# EAGLE design Shruthi-Digital-v04b (EAGLE 5.09)
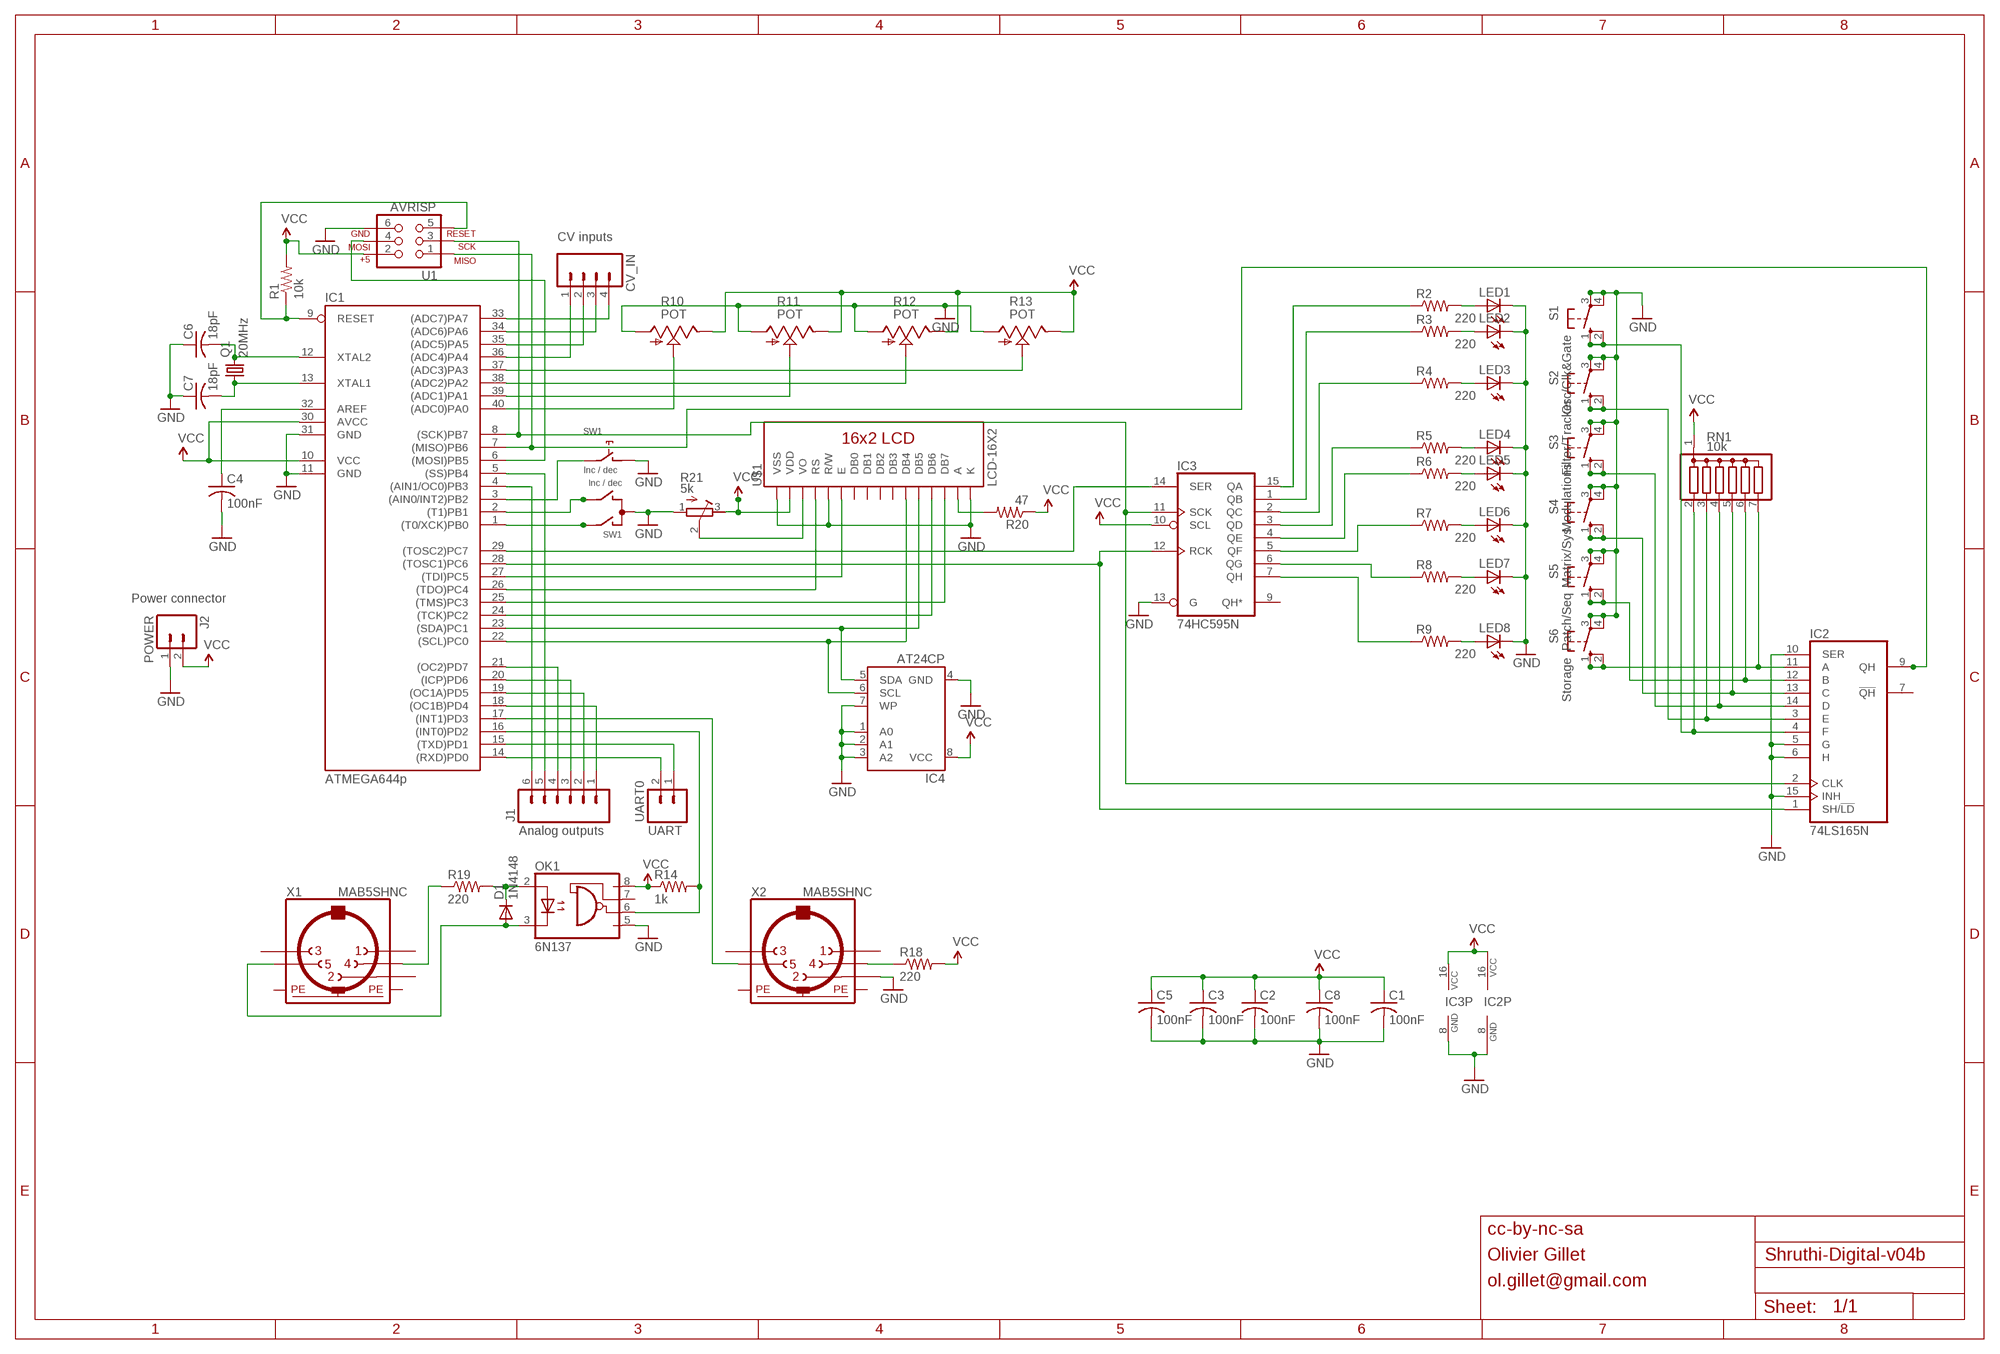
[diagram p0: schematic, sheet 1]

## Parts
C1  100nF  C-US025-024X044  [C025-024X044]
C2  100nF  C-US025-024X044  [C025-024X044]
C3  100nF  C-US025-024X044  [C025-024X044]
C4  100nF  C-US025-024X044  [C025-024X044]
C5  100nF  C-US025-024X044  [C025-024X044]
C6  18pF  C-US025-024X044  [C025-024X044]
C7  18pF  C-US025-024X044  [C025-024X044]
C8  100nF  C-US025-024X044  [C025-024X044]
CV_IN  M04PTH  [1X04]
D1  1N4148  DIODE-D-5  [D-5]
IC1  ATMEGA644p  MEGA16-P  [DIL40]
IC2  74LS165N  [DIL16]
IC3  74HC595N  [DIL16]
IC4  AT24CP  [DIL08]
J1  M06SIP  [1X06]
J2  POWER  M02PTH  [1X02]
LED1  LED3MM  [LED3MM]
LED2  LED3MM  [LED3MM]
LED3  LED3MM  [LED3MM]
LED4  LED3MM  [LED3MM]
LED5  LED3MM  [LED3MM]
LED6  LED3MM  [LED3MM]
LED7  LED3MM  [LED3MM]
LED8  LED3MM  [LED3MM]
OK1  6N137  [DIL08]
Q1  20MHz  CRYSTALHC49U-V  [HC49U-V]
R1  10k  R-US_0204/7  [0204/7]
R2  220  R-US_0204/7  [0204/7]
R3  220  R-US_0204/7  [0204/7]
R4  220  R-US_0204/7  [0204/7]
R5  220  R-US_0204/7  [0204/7]
R6  220  R-US_0204/7  [0204/7]
R7  220  R-US_0204/7  [0204/7]
R8  220  R-US_0204/7  [0204/7]
R9  220  R-US_0204/7  [0204/7]
R10  POT  POT_US  [ALPS_POT_SFE]
R11  POT  POT_US  [ALPS_POT_SFE]
R12  POT  POT_US  [ALPS_POT_SFE]
R13  POT  POT_US  [ALPS_POT_SFE]
R14  1k  R-US_0204/7  [0204/7]
R18  220  R-US_0204/7  [0204/7]
R19  220  R-US_0204/7  [0204/7]
R20  47  R-US_0204/7  [0204/7]
R21  5k  R-TRIMM3296W  [RTRIM3296W]
RN1  10k  G06R  [SIL7]
S1  Osc/Clk&Gate  40-XX  [B3F-40XX]
S2  Filter/Tracker  40-XX  [B3F-40XX]
S3  Modulations  40-XX  [B3F-40XX]
S4  Matrix/Sys  40-XX  [B3F-40XX]
S5  Patch/Seq  40-XX  [B3F-40XX]
S6  Storage  40-XX  [B3F-40XX]
SW1  Inc / dec  EC12E_SW  [ALPS_EC12E_SW]
U1  AVRISP  AVR_SPI_PRG_6PTH  [2X3]
U$1  LCD-16X2  [LCD-16X2]
UART0  M02LOCK  [1X02_LOCK]
X1  MAB5SHNC  [MAB5SH-NC]
X2  MAB5SHNC  [MAB5SH-NC]

## Nets
GND: C1.2 C2.2 C3.2 C4.2 C5.2 C6.1 C7.1 C8.2 IC1.11(GND) IC1.31(GND) IC2.5(G) IC2.6(H) IC2.8(GND) IC2.10(SER) IC2.15(INH) IC3.8(GND) IC3.13(G) IC4.1(A0) IC4.2(A1) IC4.3(A2) IC4.4(GND) IC4.7(WP) J2.1 LED1.K(C) LED2.K(C) LED3.K(C) LED4.K(C) LED5.K(C) LED6.K(C) LED7.K(C) LED8.K(C) OK1.5(GND) R10.P$3(A) R11.P$3(A) R12.P$3(A) R13.P$3(A) R21.1(E) S1.3(P) S1.4(P1) S2.3(P) S2.4(P1) S3.3(P) S3.4(P1) S4.3(P) S4.4(P1) S5.3(P) S5.4(P1) S6.3(P) S6.4(P1) SW1.C SW1.D U1.6 U$1.1(VSS) U$1.5(R/W) U$1.16(K) X2.2
N$1: IC3.2(QC) R4.1
N$2: IC1.14((RXD)PD0) UART0.2
N$3: IC2.11(A) RN1.7 S6.1(S) S6.2(S1)
N$5: IC2.3(E) RN1.3 S2.1(S) S2.2(S1)
N$6: IC1.9(RESET) R1.1 U1.5
N$7: C4.1 IC1.32(AREF)
N$8: IC1.8((SCK)PB7) IC2.2(CLK) IC3.11(SCK) U1.3
N$9: IC1.7((MISO)PB6) IC2.9(QH) U1.1
N$10: CV_IN.1 IC1.36((ADC4)PA4)
N$11: CV_IN.2 IC1.35((ADC5)PA5)
N$12: CV_IN.3 IC1.34((ADC6)PA6)
N$13: CV_IN.4 IC1.33((ADC7)PA7)
N$14: IC1.40((ADC0)PA0) R10.P$2(S)
N$15: IC1.39((ADC1)PA1) R11.P$2(S)
N$16: IC1.38((ADC2)PA2) R12.P$2(S)
N$17: IC1.37((ADC3)PA3) R13.P$2(S)
N$18: IC1.4((AIN1/OC0)PB3) J1.6
N$19: IC1.5((SS)PB4) J1.5
N$20: IC1.18((OC1B)PD4) J1.1
N$21: IC1.19((OC1A)PD5) J1.2
N$22: IC1.20((ICP)PD6) J1.3
N$23: IC1.21((OC2)PD7) J1.4
N$25: IC1.15((TXD)PD1) UART0.1
N$26: IC1.22((SCL)PC0) IC4.6(SCL) U$1.11(DB4)
N$27: IC1.26((TDO)PC4) U$1.4(RS)
N$28: D1.C OK1.2(A) R19.2
N$29: IC1.28((TOSC1)PC6) IC2.1(SH/!LD) IC3.12(RCK)
N$30: IC3.15(QA) R2.1
N$31: IC3.1(QB) R3.1
N$33: IC3.3(QD) R5.1
N$34: IC3.4(QE) R6.1
N$35: IC3.5(QF) R7.1
N$36: IC3.7(QH) R9.1
N$37: IC3.6(QG) R8.1
N$42: LED1.A R2.2
N$43: LED2.A R3.2
N$44: LED3.A R4.2
N$45: LED4.A R5.2
N$46: LED5.A R6.2
N$47: LED6.A R7.2
N$48: LED7.A R8.2
N$49: LED8.A R9.2
N$57: IC1.6((MOSI)PB5) U1.4
N$58: IC1.29((TOSC2)PC7) IC3.14(SER)
N$59: IC2.4(F) RN1.2 S1.1(S) S1.2(S1)
N$61: IC2.14(D) RN1.4 S3.1(S) S3.2(S1)
N$62: IC2.13(C) RN1.5 S4.1(S) S4.2(S1)
N$63: IC2.12(B) RN1.6 S5.1(S) S5.2(S1)
N$64: IC1.1((T0/XCK)PB0) SW1.A
N$65: IC1.2((T1)PB1) SW1.B
N$66: IC1.3((AIN0/INT2)PB2) SW1.E
N$68: R18.1 X2.4
N$69: IC1.17((INT1)PD3) X2.5
N$70: IC1.16((INT0)PD2) OK1.6(VO) R14.2
N$71: IC1.23((SDA)PC1) IC4.5(SDA) U$1.12(DB5)
N$72: R19.1 X1.4
N$73: D1.A OK1.3(C) X1.5
N$74: IC1.24((TCK)PC2) U$1.13(DB6)
N$75: IC1.25((TMS)PC3) U$1.14(DB7)
N$76: IC1.27((TDI)PC5) U$1.6(E)
N$78: R21.2(S) U$1.3(VO)
N$79: R20.2 U$1.15(A)
N$82: C7.2 IC1.13(XTAL1) Q1.1
N$83: C6.2 IC1.12(XTAL2) Q1.2
VCC: C1.1 C2.1 C3.1 C5.1 C8.1 IC1.10(VCC) IC1.30(AVCC) IC2.16(VCC) IC3.10(SCL) IC3.16(VCC) IC4.8(VCC) J2.2 OK1.8(VCC) R1.2 R10.P$1(E) R11.P$1(E) R12.P$1(E) R13.P$1(E) R14.1 R18.2 R20.1 R21.3(A) RN1.1 U1.2 U$1.2(VDD)
Unconnected: IC2.7(!QH) IC3.9(QH*) OK1.7(VE) SW1.GND1(G) SW1.GND2(G) U$1.7(DB0) U$1.8(DB1) U$1.9(DB2) U$1.10(DB3) X1.1 X1.2 X1.3 X2.1 X2.3

## Notes on the sheet
- CV inputs
- Power connector
- Analog outputs | UART
- cc-by-nc-sa
- Olivier Gillet
- ol.gillet@gmail.com

## Power pins joined to a net without a drawn wire
PE: X1.PE X1.PE@(PE) X2.PE X2.PE@(PE)

## Library data of the parts
C1-C8 = rcl:C-US: CAPACITOR, American symbol
CV_IN = SparkFun:M04: Header 4 Standard 4-pin 0.1" header. Use with straight break away headers (SKU : PRT-00116), right angle break away headers (PRT-00553), swiss pins (PRT-00743), machine pins (PRT-00117), and female headers (PRT-00115). Molex polarized connector foot print use with SKU : PRT-08231 with associated crimp pins and housings.
D1 = diode:DIODE-: DIODE
IC1 = atmel:MEGA16-P: MICROCONTROLLER 16 Kbytes FLASH 1 kbytes SRAM 512 bytes EEPROM USART 8-channel 10 bit ADC Source: avr.lbr
IC2 = 74xx-us:74*165: 8-bit parallel load SHIFT REGISTER
IC3 = 74xx-eu:74*595: 8-bit SHIFT REGISTER, output latch
IC4 = atmel:AT24C*: 2-wire serial EEPROM
J1 = SparkFun:M06: Header 6 Standard 6-pin 0.1" header. Use with straight break away headers (SKU : PRT-00116), right angle break away headers (PRT-00553), swiss pins (PRT-00743), machine pins (PRT-00117), and female headers (PRT-00115). Molex polarized connector foot print use with SKU : PRT-08094 with associated crimp pins and housings. NOTES ON THE VARIANTS LOCK and LOCK_LONGPADS... This footprint was designed to help hold the alignment of a through-hole component (i.e. 6-pin header) while soldering it into place. You may notice that each hole has been shifted either up or down by 0.005 of an inch from it's more standard position (which is a perfectly straight line). This slight alteration caused the pins (the squares in the middle) to touch the edges of the holes. Because they are alternating, it causes a "brace" to hold the component in place. 0.005 has proven to be the perfect amount of "off-center" position when using our standard breakaway headers. Although looks a little odd when you look at the bare footprint, once you have a header in there, the alteration is very hard to notice. Also, if you push a header all the way into place, it is covered up entirely on the bottom side. This idea of altering the position of holes to aid alignment will be further integrated into the Sparkfun Library for other footprints. It can help hold any component with 3 or more connection pins.
J2 UART0 = SparkFun:M02: Header 2 Standard 2-pin 0.1" header. Use with straight break away headers (SKU : PRT-00116), right angle break away headers (PRT-00553), swiss pins (PRT-00743), machine pins (PRT-00117), and female headers (PRT-00115). Molex polarized connector foot print use with SKU : PRT-08233 with associated crimp pins and housings.
LED1-LED8 = led:LED: LED OSRAM: - CHIPLED LG R971, LG N971, LY N971, LG Q971, LY Q971, LO R971, LY R971 LH N974, LH R974 LS Q976, LO Q976, LY Q976 LO Q996 - Hyper CHIPLED LW Q18S LB Q993, LB Q99A, LB R99A - SideLED LS A670, LO A670, LY A670, LG A670, LP A670 LB A673, LV A673, LT A673, LW A673 LH A674 LY A675 LS A676, LA A676, LO A676, LY A676, LW A676 LS A679, LY A679, LG A679 - Hyper Micro SIDELED® LS Y876, LA Y876, LO Y876, LY Y876 LT Y87S - SmartLED LW L88C, LW L88S LB L89C, LB L89S, LG L890 LS L89K, LO L89K, LY L89K LS L896, LA L896, LO L896, LY L896 - TOPLED LS T670, LO T670, LY T670, LG T670, LP T670 LSG T670, LSP T670, LSY T670, LOP T670, LYG T670 LG T671, LOG T671, LSG T671 LB T673, LV T673, LT T673, LW T673 LH T674 LS T676, LA T676, LO T676, LY T676, LB T676, LH T676, LSB T676, LW T676 LB T67C, LV T67C, LT T67C, LS T67K, LO T67K, LY T67K, LW E67C LS E67B, LA E67B, LO E67B, LY E67B, LB E67C, LV E67C, LT E67C LW T67C LS T679, LY T679, LG T679 LS T770, LO T770, LY T770, LG T770, LP T770 LB T773, LV T773, LT T773, LW T773 LH T774 LS E675, LA E675, LY E675, LS T675 LS T776, LA T776, LO T776, LY T776, LB T776 LHGB T686 LT T68C, LB T68C - Hyper Mini TOPLED® LB M676 - Mini TOPLED Santana® LG M470 LS M47K, LO M47K, LY M47K Source: http://www.osram.convergy.de LUXEON: - LUMILED® LXK2-PW12-R00, LXK2-PW12-S00, LXK2-PW14-U00, LXK2-PW14-V00 LXK2-PM12-R00, LXK2-PM12-S00, LXK2-PM14-U00 LXK2-PE12-Q00, LXK2-PE12-R00, LXK2-PE12-S00, LXK2-PE14-T00, LXK2-PE14-U00 LXK2-PB12-K00, LXK2-PB12-L00, LXK2-PB12-M00, LXK2-PB14-N00, LXK2-PB14-P00, LXK2-PB14-Q00 LXK2-PR12-L00, LXK2-PR12-M00, LXK2-PR14-Q00, LXK2-PR14-R00 LXK2-PD12-Q00, LXK2-PD12-R00, LXK2-PD12-S00 LXK2-PH12-R00, LXK2-PH12-S00 LXK2-PL12-P00, LXK2-PL12-Q00, LXK2-PL12-R00 Source: www.luxeon.com KINGBRIGHT: KA-3528ASYC Source: www.kingbright.com
OK1 = optocoupler:6N137: MOTOROLA OPTO COUPLER
Q1 = crystal:CRYSTAL: CRYSTAL
R1-R9 R14 R18-R20 = rcl:R-US_: RESISTOR, American symbol
R10-R13 = pot-alps:POT_US
R21 = rcl:R-TRIMM: Trimm resistor
RN1 = resistor-sil:G06R: SIL RESISTOR
S1-S6 = switch-omron:40-XX: OMRON SWITCH
SW1 = switch-alps:EC12E_SW: ALPS rotary Encoder EC12E series with switch
U1 = SparkFun:AVR_SPI_PRG_6: AVR ISP 6 Pin This is the reduced ISP connector for AVR programming. Common on Arduino. This footprint will take up less PCB space and can be used with a 10-pin to 6-pin adapter such as SKU: BOB-08508
U$1 = SparkFun:LCD-16X2
X1 X2 = con-hirschmann:MAB5SH: Female CONNECTOR 5 pins 90 deg. with shield, horizontal (DIN 41524)

## Board
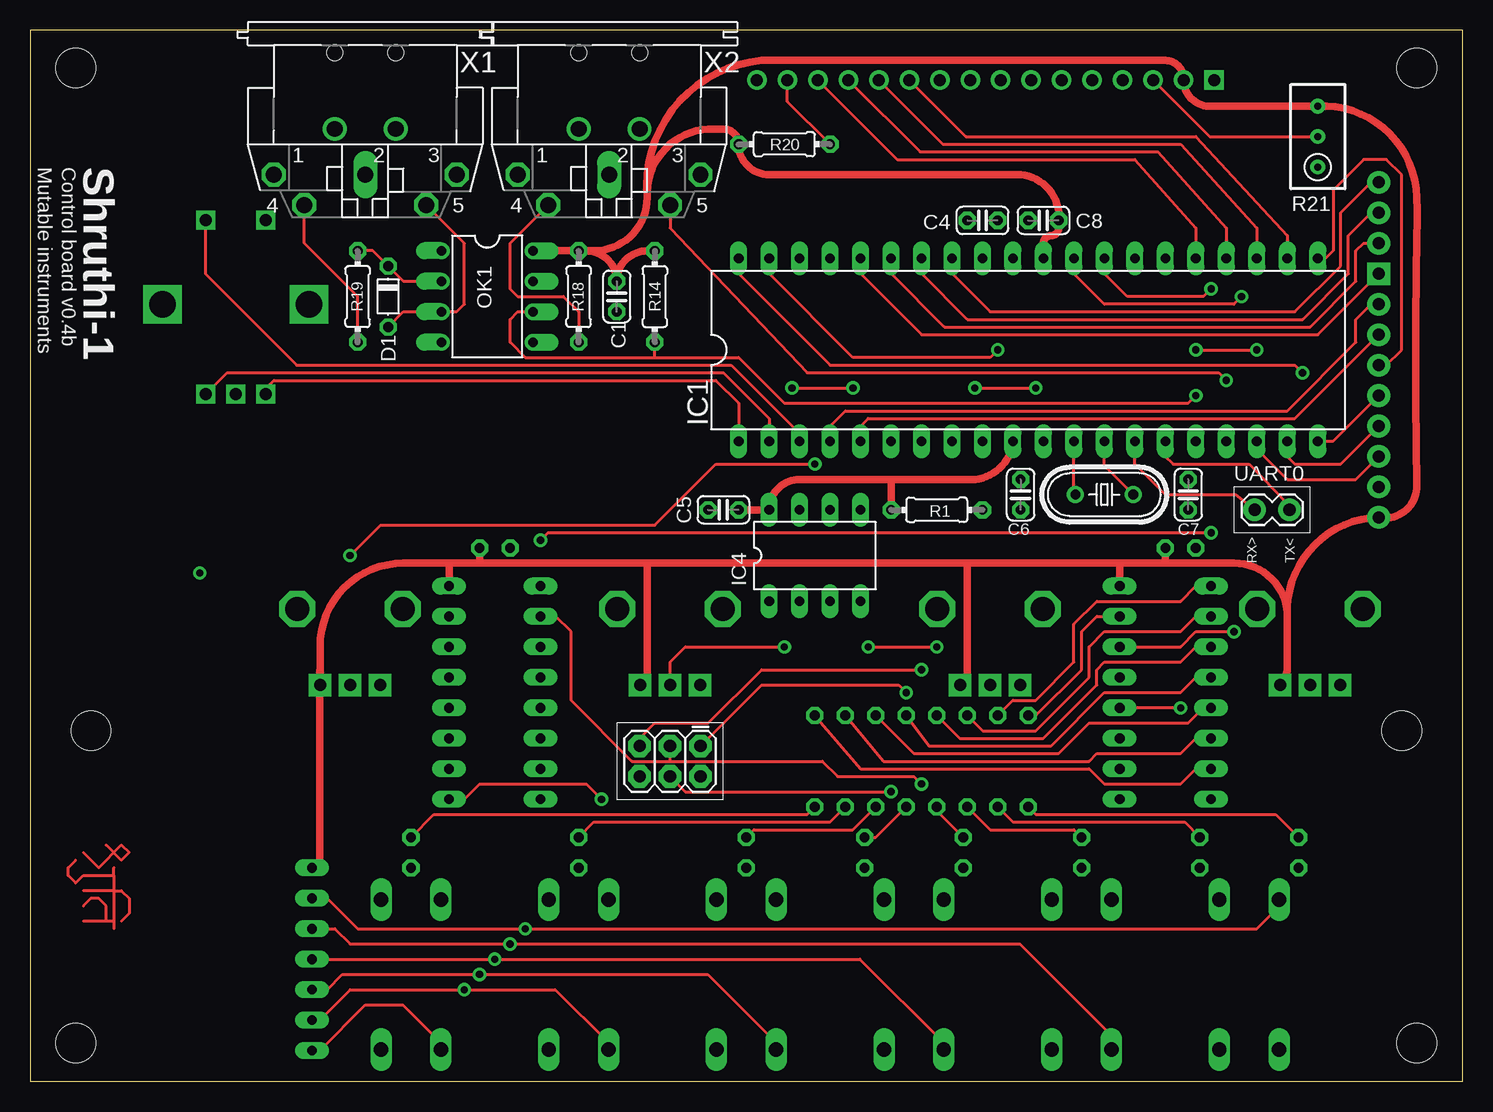
[diagram p1: board, top side]
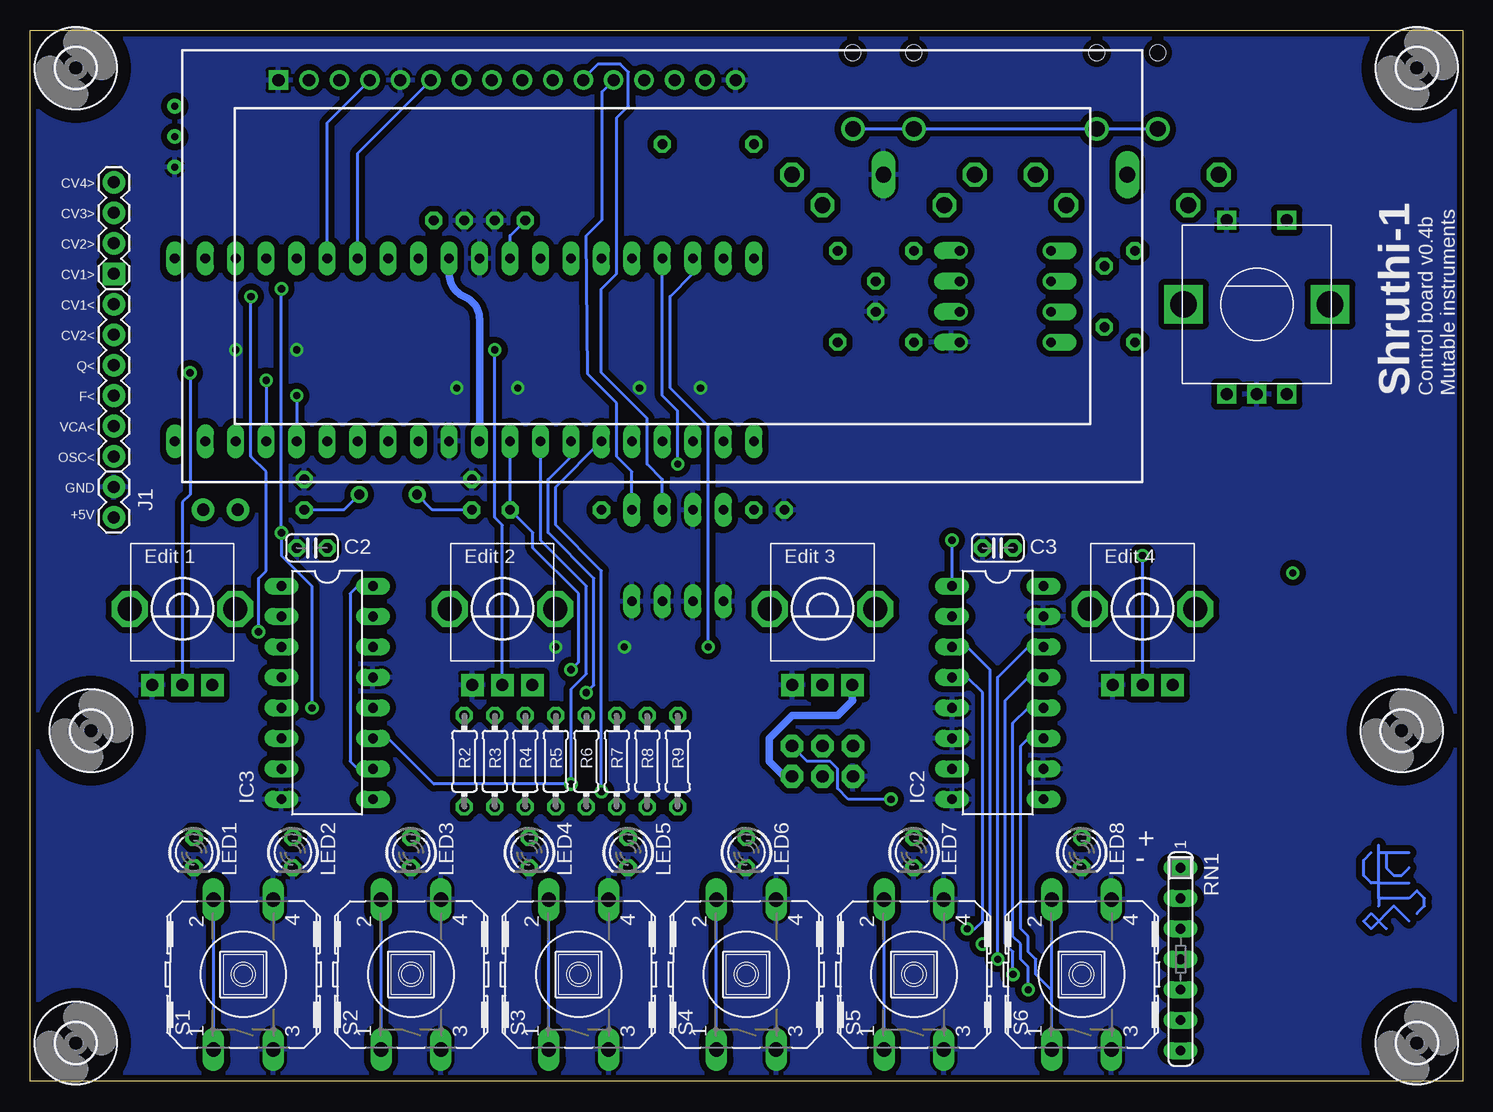
[diagram p2: board, bottom side, seen from below]

Size 119.38 x 87.63 mm. Coordinates in mm from the lower left corner, seen from the top.
Outline: 0,0 119.38,0 119.38,87.63 0,87.62 0,0
Copper layers (1*16): Top 0.035mm / dielectric 1.5mm / Bottom 0.035mm
Design rules "SparkFun": minimum track width 8mil, minimum drill 20mil, track to track 8mil, track to pad 8mil, pad to pad 8mil, via to via 8mil, smd to smd 8mil, copper to edge 10mil, drill to drill 8mil, minimum pad ring 12mil, minimum via ring 10mil, stop-mask expansion 4mil, vias tented up to drill 25mil, thermal gap 10mil

### Footprints (pad centres in the part's own frame; a part is rotated, then mirrored left to right if it is on the bottom)
C025-024X044 = drill 0.813 octagon: 1 -1.27,0; 2 1.27,0
1X04 = drill 1.016 pad 1.88 square: 1 0,0 | drill 1.016 pad 1.88 round: 2 2.54,0; 3 5.08,0; 4 7.62,0
D-5 = drill 0.813 octagon: A 2.54,0; C -2.54,0
DIL40 = drill 0.813 long: 1 -24.13,-7.62; 2 -21.59,-7.62; 3 -19.05,-7.62; 4 -16.51,-7.62; 5 -13.97,-7.62; 6 -11.43,-7.62; 7 -8.89,-7.62; 8 -6.35,-7.62; 9 -3.81,-7.62; 10 -1.27,-7.62; 11 1.27,-7.62; 12 3.81,-7.62; 13 6.35,-7.62; 14 8.89,-7.62; 15 11.43,-7.62; 16 13.97,-7.62; 17 16.51,-7.62; 18 19.05,-7.62; 19 21.59,-7.62; 20 24.13,-7.62; 21 24.13,7.62; 22 21.59,7.62; 23 19.05,7.62; 24 16.51,7.62; 25 13.97,7.62; 26 11.43,7.62; 27 8.89,7.62; 28 6.35,7.62; 29 3.81,7.62; 30 1.27,7.62; 31 -1.27,7.62; 32 -3.81,7.62; 33 -6.35,7.62; 34 -8.89,7.62; 35 -11.43,7.62; 36 -13.97,7.62; 37 -16.51,7.62; 38 -19.05,7.62; 39 -21.59,7.62; 40 -24.13,7.62
DIL16 = drill 0.813 long: 1 -8.89,-3.81; 2 -6.35,-3.81; 3 -3.81,-3.81; 4 -1.27,-3.81; 5 1.27,-3.81; 6 3.81,-3.81; 7 6.35,-3.81; 8 8.89,-3.81; 9 8.89,3.81; 10 6.35,3.81; 11 3.81,3.81; 12 1.27,3.81; 13 -1.27,3.81; 14 -3.81,3.81; 15 -6.35,3.81; 16 -8.89,3.81
DIL08 = drill 0.813 long: 1 -3.81,-3.81; 2 -1.27,-3.81; 3 1.27,-3.81; 4 3.81,-3.81; 5 3.81,3.81; 6 1.27,3.81; 7 -1.27,3.81; 8 -3.81,3.81
1X06 = drill 1.016 pad 1.88 round: 1 0,0; 2 2.54,0; 3 5.08,0; 4 7.62,0; 5 10.16,0; 6 12.7,0
1X02 = drill 1.016 pad 1.88 round: 1 0,0; 2 2.54,0
LED3MM = drill 0.813 octagon: A -1.27,0; K 1.27,0
DIL08' = drill 0.813 offset: 1 -3.81,-3.81; 2 -1.27,-3.81; 3 1.27,-3.81; 4 3.81,-3.81; 5 3.81,3.81; 6 1.27,3.81; 7 -1.27,3.81; 8 -3.81,3.81
HC49U-V = drill 0.813 round: 1 -2.413,0; 2 2.413,0
0204/7 = drill 0.813 octagon: 1 -3.81,0; 2 3.81,0
ALPS_POT_SFE = drill 1 pad 1.88 square: P$1 -2.5,6.35; P$2 0,6.35; P$3 2.5,6.35 | drill 2 octagon: P$4 -4.4,0; P$5 4.4,0
RTRIM3296W = drill 0.61 round: 1 0,-2.54; 2 0,0; 3 0,2.54
SIL7 = drill 0.813 long: 1 -7.62,0; 2 -5.08,0; 3 -2.54,0; 4 0,0; 5 2.54,0; 6 5.08,0; 7 7.62,0
B3F-40XX = drill 1.194 long: 1 -6.248,2.489; 2 6.248,2.489; 3 -6.248,-2.489; 4 6.248,-2.489
ALPS_EC12E_SW = drill 1 square: A -2.5,-7.5; B 2.5,-7.5; C 0,-7.5; D -2.5,7; E 2.5,7 | drill 2.2 square: GND1 -6.1,0; GND2 6.1,0
2X3 = drill 1.016 pad 1.88 octagon: 1 0,0; 2 0,2.54; 3 2.54,0; 4 2.54,2.54; 5 5.08,0; 6 5.08,2.54
LCD-16X2 = drill 1.016 square: 1 -32,15.5 | drill 1.016 round: 2 -29.46,15.5; 3 -26.92,15.5; 4 -24.38,15.5; 5 -21.84,15.5; 6 -19.3,15.5; 7 -16.76,15.5; 8 -14.22,15.5; 9 -11.68,15.5; 10 -9.14,15.5; 11 -6.6,15.5; 12 -4.06,15.5; 13 -1.52,15.5; 14 1.02,15.5; 15 3.56,15.5; 16 6.1,15.5
3,3 = hole 3.3: 0,0
1X02_LOCK = drill 1.016 pad 1.88 round: 1 -0.178,0; 2 2.718,0
MAB5SH-NC = drill 1.321 octagon: 1 7.62,7.62; 3 -7.62,7.62; 4 5.08,10.16; 5 -5.08,10.16 | drill 1.321 long: 2 0,7.62 | drill 1.321 round: PE -2.54,3.81; PE@ 2.54,3.81 | hole 1.321: -2.54,-2.54; 2.54,-2.54

### Placement (x,y rotation side)
C1  48.9,65.41 270 top
C2  95.89,44.45 180 bottom
C3  38.73,44.45 180 bottom
C4  79.38,71.76 0 top
C5  57.79,47.62 180 top
C6  82.55,48.89 270 top
C7  96.52,48.89 270 top
C8  84.45,71.76 180 top
CV_IN  112.39,67.31 90 bottom
D1  29.84,65.41 270 top
IC1  83.19,60.96 0 top
IC2  38.73,32.38 270 bottom
IC3  94.61,32.38 270 bottom
IC4  65.41,43.81 0 top
J1  112.39,52.07 90 bottom
J2  112.39,49.53 270 bottom
LED1  105.71,19.05 270 bottom
LED2  97.49,19.05 270 bottom
LED3  87.63,19.05 270 bottom
LED4  77.77,19.05 270 bottom
LED5  69.55,19.05 270 bottom
LED6  59.69,19.05 270 bottom
LED7  45.72,19.05 270 bottom
LED8  31.75,19.05 270 bottom
OK1  6N137  [DIL08']  38.1,65.41 270 top
Q1  89.53,48.89 180 top
R1  75.56,47.62 180 top
R2  83.19,26.67 270 bottom
R3  80.64,26.67 270 bottom
R4  78.11,26.67 270 bottom
R5  75.56,26.67 270 bottom
R6  73.02,26.67 270 bottom
R7  70.48,26.67 270 bottom
R8  67.94,26.67 270 bottom
R9  65.41,26.67 270 bottom
R10  106.68,39.37 180 bottom
R11  80.01,39.37 180 bottom
R12  53.34,39.37 180 bottom
R13  26.67,39.37 180 bottom
R14  52.07,65.41 270 top
R18  45.72,65.41 90 top
R19  27.3,65.41 90 top
R20  62.87,78.11 0 top
R21  107.31,78.74 0 top
RN1  23.49,10.16 270 bottom
S1  101.6,8.89 90 bottom
S2  87.63,8.89 90 bottom
S3  73.66,8.89 90 bottom
S4  59.69,8.89 90 bottom
S5  45.72,8.89 90 bottom
S6  31.75,8.89 90 bottom
SW1  17.14,64.77 0 bottom
U1  55.88,27.94 180 top
U$1  66.67,67.95 0 bottom
U$2  [3,3]  115.57,84.46 0 bottom
U$3  [3,3]  115.57,3.17 0 bottom
U$4  [3,3]  3.81,3.17 0 bottom
U$5  [3,3]  3.81,84.46 0 bottom
U$6  [3,3]  5.08,29.21 0 bottom
U$7  [3,3]  114.3,29.21 0 bottom
UART0  104.78,47.62 180 top
X1  27.94,83.19 180 top
X2  48.26,83.19 180 top

### Tracks (layer width: path | path; a pad name or v marks a point on that pad's centre or on a via)
GND  (via drill 0.6)
  Top 0.254: v97.16,60.96 v102.23,60.96 | v63.5,57.78 v68.58,57.78 | v78.74,57.78 v83.82,57.78 | v69.85,36.2 v75.56,36.2
  pour Bottom (isolate 0.508): 0.63,87 0.63,0.64 118.75,0.64 118.75,87
N$1
  Top 0.254: R4.1 79.38,29.21 83.82,29.21 88.27,33.66 88.27,36.2 89.53,37.46 95.89,37.46 97.16,38.73 IC3.2
N$2
  Top 0.254: IC1.14 92.08,51.44 94.61,48.89 100.46,48.89 UART0.2
N$3
  Top 0.254: S6.1 34.24,3.17 31.06,6.35 27.94,6.35 24.13,2.54 RN1.7
  Bottom 0.254: S6.1 34.24,7.62 | 34.24,7.62 S6.2 34.24,15.19 | IC2.11 36.2,28.57 36.83,27.94 36.83,12.7 36.2,12.07 36.2,10.8 35.56,10.16 35.56,8.89 34.29,7.62 34.24,7.62
N$4
  Top 0.254: 4.45,19.05 5.71,17.78 7.62,19.68 8.25,19.05 7.62,18.41 6.35,19.68
N$5  (via drill 0.6)
  Top 0.254: S2.1 90.12,3.81 82.5,11.43 v40.01,11.43 26.67,11.43 25.4,12.7 RN1.3
  Bottom 0.254: S2.1 S2.2 | IC2.3 41.27,36.2 39.37,34.29 39.37,12.07 v40.01,11.43
N$6  (via drill 0.6)
  Top 0.254: v74.3,34.29 60.96,34.29 56.52,29.84 52.07,29.84 50.8,28.57 U1.5
  Bottom 0.254: IC1.9 R1.1 77.47,45.72 77.47,44.45 73.66,40.64 73.66,34.92 v74.3,34.29
N$7
  Bottom 0.254: IC1.32 79.38,70.48 C4.1
N$8  (via drill 0.6)
  Top 0.254: v74.3,24.77 73.66,25.4 67.31,25.4 66.04,26.67 53.34,26.67 | 53.34,26.67 50.16,26.67 45.09,31.75 45.09,37.46 43.82,38.73 IC2.2 | 53.34,26.67 U1.3
  Bottom 0.254: IC1.8 76.84,45.09 73.02,41.27 73.02,33.96 74.3,32.69 v74.3,24.77 85.73,24.77 89.53,28.57 IC3.11
N$9  (via drill 0.6)
  Top 0.254: v73.02,32.38 72.39,33.02 60.96,33.02 U1.1 | v47.62,23.49 46.36,24.77 37.47,24.77 36.2,23.49 IC2.9
  Bottom 0.254: IC1.7 74.3,52.07 76.2,50.16 76.2,45.72 72.39,41.91 72.39,33.02 v73.02,32.38 | U1.1 54.61,26.67 52.7,26.67 52.07,26.04 52.07,24.39 51.17,23.49 v47.62,23.49
N$10
  Top 0.254: IC1.36 69.22,67.31 74.3,62.23 107.31,62.23 CV_IN.1
N$11
  Top 0.254: IC1.35 71.75,67.31 76.2,62.87 106.68,62.87 110.49,66.68 110.49,69.22 111.12,69.85 CV_IN.2
N$12
  Top 0.254: IC1.34 74.3,67.31 78.11,63.5 106.05,63.5 109.86,67.31 109.86,70.48 111.76,72.39 CV_IN.3
N$13
  Top 0.254: IC1.33 76.84,67.31 80.01,64.14 105.41,64.14 109.22,67.95 109.22,72.39 111.76,74.93 CV_IN.4
N$14  (via drill 0.6)
  Top 0.254: IC1.40 59.05,67.31 66.67,59.69 105.41,59.69 v106.05,59.05
  Bottom 0.254: v106.05,59.05 106.05,48.89 106.68,48.26 R10.P$2
N$15  (via drill 0.6)
  Top 0.254: IC1.39 61.59,67.31 68.58,60.32 80.01,60.32 v80.64,60.96
  Bottom 0.254: v80.64,60.96 80.64,46.99 80.01,46.35 R11.P$2
N$16  (via drill 0.6)
  Top 0.254: R12.P$2 53.34,34.92 54.61,36.2 v62.87,36.2
  Bottom 0.254: IC1.38 64.14,67.31 66.04,65.41 66.04,57.78 62.87,54.61 v62.87,36.2
N$17  (via drill 0.6)
  Top 0.254: v26.67,43.81 29.21,46.35 52.07,46.35 57.15,51.44 64.14,51.44 v65.41,51.44
  Bottom 0.254: R13.P$2 v26.67,43.81 | IC1.37 66.67,57.15 65.41,55.88 v65.41,51.44
N$18
  Top 0.254: IC1.4 66.67,54.61 67.94,55.88 104.78,55.88 110.49,61.59 110.49,63.5 111.76,64.77 J1.6
N$19
  Top 0.254: IC1.5 69.22,54.61 69.85,55.24 105.41,55.24 J1.5
N$20
  Top 0.254: IC1.18 102.23,52.7 104.78,50.16 110.49,50.16 J1.1
N$21
  Top 0.254: IC1.19 104.78,52.07 105.41,51.44 109.22,51.44 J1.2
N$22
  Top 0.254: IC1.20 108.59,53.34 J1.3
N$23
  Top 0.254: IC1.21 107.95,68.58 108.59,69.22 108.59,74.3 111.12,76.84 113.03,76.84 114.3,75.57 114.3,60.96 113.03,59.69 J1.4
N$24  (via drill 0.6)
  other vias: 14.15,42.37
N$25
  Top 0.254: IC1.15 94.61,52.07 95.25,51.44 101.6,51.44 104.78,48.13 UART0.1
N$26
  Top 0.254: U$1.11 77.98,78.74 97.16,78.74 104.78,70.48 IC1.22
  Bottom 0.254: U$1.11 73.27,83.57 72.06,84.79 70.18,84.79 69.52,84.12 69.52,81.28 70.48,80.32 70.48,67.31 71.75,66.04 71.75,59.05 67.94,55.24 67.94,51.44 66.67,50.16 IC4.6
N$27
  Bottom 0.254: U$1.4 94.61,79.89 IC1.26
N$28
  Top 0.254: OK1.2 31.12,66.68 D1.C 28.58,69.22 R19.2
N$29  (via drill 0.6)
  Top 0.254: IC1.28 89.53,67.31 91.44,65.41 97.79,65.41 v98.42,66.04 | v42.55,45.09 43.18,45.72 v98.42,45.72 | v95.89,31.11 IC3.12
  Bottom 0.254: v98.42,66.04 v98.42,45.72 98.42,43.81 95.89,41.27 v95.89,31.11 | IC2.1 v42.55,45.09
N$30
  Top 0.254: R2.1 83.82,30.48 87.63,34.29 87.63,37.46 88.9,38.73 IC3.15
N$31
  Top 0.254: R3.1 81.92,31.75 83.82,31.75 87,34.92 87,38.1 88.9,40.01 95.89,40.01 97.16,41.27 IC3.1
N$33
  Top 0.254: R5.1 77.47,28.57 84.45,28.57 88.9,33.02 88.9,34.29 89.53,34.92 95.89,34.92 97.16,36.2 IC3.3
N$34
  Top 0.254: R6.1 74.93,27.94 85.09,27.94 89.53,32.38 95.89,32.38 97.16,33.66 IC3.4
N$35
  Top 0.254: R7.1 73.66,27.3 85.73,27.3 88.27,29.84 96.52,29.84 97.79,31.11 IC3.5
N$36
  Top 0.254: R9.1 69.22,26.04 88.27,26.04 89.53,24.77 95.89,24.77 97.16,26.04 IC3.7
N$37
  Top 0.254: R8.1 71.12,26.67 88.27,26.67 88.9,27.3 95.89,27.3 97.16,28.57 IC3.6
N$42
  Top 0.254: R2.2 83.82,22.22 103.81,22.22 LED1.A
N$43
  Top 0.254: R3.2 81.92,21.59 96.22,21.59 LED2.A
N$44
  Top 0.254: R4.2 80.01,20.95 87,20.95 LED3.A
N$45
  Top 0.254: LED4.A 75.56,22.53 R5.2
N$46
  Top 0.254: LED5.A 70.48,20.32 R6.2
N$47
  Top 0.254: R7.2 68.58,20.95 60.33,20.95 LED6.A
N$48
  Top 0.254: R8.2 66.67,21.59 46.99,21.59 LED7.A
N$49
  Top 0.254: R9.2 64.77,22.22 33.66,22.22 LED8.A
N$52
  Top 0.254: 6.98,17.14 6.98,17.78 | 6.98,17.14 6.98,15.88 | 6.98,15.88 6.98,13.34 | 6.98,13.34 6.98,12.7 | 6.35,13.34 4.45,13.34 | 6.98,13.34 6.35,13.34 | 6.35,13.34 6.35,14.61 5.71,15.24 5.08,15.24 4.45,14.61 | 6.98,17.14 4.45,17.14 3.81,16.51 3.17,17.14 3.17,17.78 3.81,18.41 | 6.98,15.88 4.45,15.88 | 6.98,15.88 7.62,15.88 8.25,15.24 8.25,13.97 7.62,13.34
N$53
  Bottom 0.254: 4.45,13.34 5.71,14.61 7.62,12.7 8.25,13.34 7.62,13.97 6.35,12.7
N$54
  Bottom 0.254: 6.98,15.24 6.98,14.61 | 6.98,15.24 6.98,16.51 | 6.98,16.51 6.98,19.05 | 6.98,19.05 6.98,19.68 | 6.35,19.05 4.45,19.05 | 6.98,19.05 6.35,19.05 | 6.35,19.05 6.35,17.78 5.71,17.14 5.08,17.14 4.45,17.78 | 6.98,15.24 4.45,15.24 3.81,15.88 3.17,15.24 3.17,14.61 3.81,13.97 | 6.98,16.51 4.45,16.51 | 6.98,16.51 7.62,16.51 8.25,17.14 8.25,18.41 7.62,19.05
N$57  (via drill 0.6)
  Top 0.254: U1.4 54.61,24.13 v71.75,24.13
  Bottom 0.254: IC1.6 75.56,49.53 75.56,46.35 71.75,42.55 v71.75,24.13
N$58  (via drill 0.6)
  Top 0.254: v100.97,65.41 100.33,64.77 89.53,64.77 87,67.31 IC1.29 | IC3.14 95.89,36.2 97.16,37.46 v100.33,37.46
  Bottom 0.254: v100.33,37.46 100.33,41.91 99.7,42.55 99.7,50.8 100.97,52.07 v100.97,65.41
N$59  (via drill 0.6)
  Top 0.254: S1.2 104.09,14.66 104.14,14.61 102.23,12.7 v41.27,12.7 27.3,12.7 24.77,15.24 RN1.2
  Bottom 0.254: S1.2 S1.1 | IC2.4 41.27,33.66 40.01,32.38 40.01,13.34 40.64,12.7 v41.27,12.7
N$61  (via drill 0.6)
  Top 0.254: S3.1 76.15,3.17 69.16,10.16 v38.73,10.16 RN1.4
  Bottom 0.254: S3.1 S3.2 | IC2.14 36.2,36.2 38.73,33.66 v38.73,10.16
N$62  (via drill 0.6)
  Top 0.254: S4.1 62.18,3.17 56.46,8.89 v37.47,8.89 26.04,8.89 24.77,7.62 RN1.5
  Bottom 0.254: S4.1 S4.2 | IC2.13 36.2,33.66 38.1,31.75 38.1,11.43 37.47,10.8 v37.47,8.89
N$63  (via drill 0.6)
  Top 0.254: S5.1 48.21,3.17 43.76,7.62 v36.2,7.62 26.67,7.62 24.13,5.08 RN1.6
  Bottom 0.254: S5.1 S5.2 | IC2.12 36.2,31.11 37.47,29.84 37.47,12.07 36.83,11.43 36.83,10.16 36.2,9.53 v36.2,7.62
N$64
  Top 0.254: SW1.A 19.64,57.74 20.32,58.42 57.15,58.42 59.05,56.52 IC1.1
N$65
  Top 0.254: IC1.2 61.59,55.24 57.79,59.05 16.43,59.05 SW1.B
N$66
  Top 0.254: IC1.3 64.14,53.98 58.42,59.69 22.23,59.69 14.61,67.31 14.64,67.35 SW1.E
N$68
  Top 0.254: R18.1 45.72,64.14 44.45,65.41 40.64,65.41 40.01,66.04 40.01,69.85 X2.4
N$69  (via drill 0.6)
  Top 0.254: X2.5 53.34,71.12 64.77,59.05 99.06,59.05 v99.7,58.42
  Bottom 0.254: v99.7,58.42 IC1.17
N$70  (via drill 0.6)
  Top 0.254: v97.16,57.15 96.52,56.52 62.87,56.52 59.05,60.32 52.07,60.32 | 52.07,60.32 41.27,60.32 40.01,61.59 40.01,63.5 40.64,64.14 OK1.6 | 52.07,60.32 R14.2
  Bottom 0.254: v97.16,57.15 IC1.16
N$71
  Top 0.254: U$1.12 76.08,78.11 95.89,78.11 102.23,71.12 IC1.23
  Bottom 0.254: IC4.5 69.22,50.8 70.48,52.07 70.48,56.52 72.9,58.93 73.02,70.48 71.69,71.82 71.69,82.49 U$1.12
N$72
  Top 0.254: X1.4 22.86,69.85 27.3,65.41 R19.1
N$73
  Top 0.254: X1.5 36.2,69.85 36.2,64.77 35.56,64.14 OK1.3 31.12,64.14 D1.A
N$74
  Top 0.254: U$1.13 74.17,77.47 93.98,77.47 99.7,71.12 IC1.24
N$75
  Top 0.254: IC1.25 97.16,71.12 92.08,76.84 72.27,76.84 U$1.14
N$76
  Bottom 0.254: U$1.6 92.08,77.35 IC1.27
N$78
  Top 0.254: U$1.3 98.3,78.74 R21.2
N$79
  Top 0.254: R20.2 63.12,81.67 U$1.15
N$82
  Top 0.254: IC1.13 89.53,51.31 Q1.1
  Bottom 0.254: Q1.1 93.22,47.62 C7.2
N$83
  Top 0.254: IC1.12 87,49.4 Q1.2
  Bottom 0.254: Q1.2 85.85,47.62 C6.2
PE
  Bottom 0.254: X1.PE@ X1.PE X2.PE@ X2.PE
VCC
  Top 0.61: OK1.8 R18.2 46.36,69.22 | 51.44,43.18 78.11,43.18 | R11.P$1 78.11,33.62 78.11,43.18 | R12.P$1 51.44,33.62 51.44,43.18 | 78.11,43.18 90.81,43.18 | 51.44,73.66 arc-90 60.96,85.09 94.61,85.09 arc-95 U$1.2 arc93 98.42,81.28 R21.3 arc-92 115.57,73.66 arc-3 115.57,70.48 arc3 115.57,49.67 arc-102 J2.2 arc92 104.78,38.73 | 51.44,73.66 arc-90 46.99,69.22 46.36,69.22 | 46.36,69.22 arc-90 C1.1 arc-90 51.44,69.22 R14.1 | 51.44,73.66 arc-90 56.52,79.38 57.79,79.38 arc-90 R20.1 arc90 61.59,75.57 82.55,75.57 arc-90 C8.1 85.73,71.12 arc-90 85.09,70.48 arc90 84.45,69.85 IC1.30 | 34.92,43.18 31.12,43.18 arc90 24.17,36.23 R13.P$1 24.13,34.25 24.13,18.41 RN1.1 | 34.92,43.18 37.47,43.18 | 37.47,43.18 51.44,43.18 | 34.92,43.18 IC2.16 | 90.81,43.18 IC3.16 | 90.81,43.18 94.61,43.18 | 94.61,43.18 C2.1 | 104.78,38.73 104.78,34.25 arc-35 R10.P$1 | 94.61,43.18 100.33,43.18 arc-90 104.78,38.73 | 37.47,43.18 C3.1 | C5.1 IC4.8 arc-90 64.14,50.16 71.75,50.16 | 71.75,50.16 78.11,50.16 arc90 IC1.10 | 71.75,50.16 R1.2
  Bottom 0.254: IC3.10 92.08,26.04 92.71,26.67 92.71,40.64 92.08,41.27 IC3.16
  Bottom 0.61: U1.2 56.52,25.4 57.79,26.67 57.79,28.57 55.88,30.48 52.07,30.48 50.8,31.75 50.84,31.79 R12.P$1 50.8,32.98 | IC1.10 81.92,63.5 arc-67 83.19,65.41 arc67 84.45,67.31 IC1.30

### Text on the board
tPlace: RX> | TX<
bPlace: CV4> | CV3> | CV2> | CV1> | CV1< | CV2< | Q< | F< | VCA< | OSC< | GND | +5V | Edit 4 | Edit 3 | Edit 2 | Edit 1 | + | -
tNames: Mutable instruments | Control board v0.4b | Shruthi-1
bNames: Mutable instruments | Control board v0.4b | Shruthi-1